# EAGLE design USB_5Vswitch (EAGLE 9.4.2)
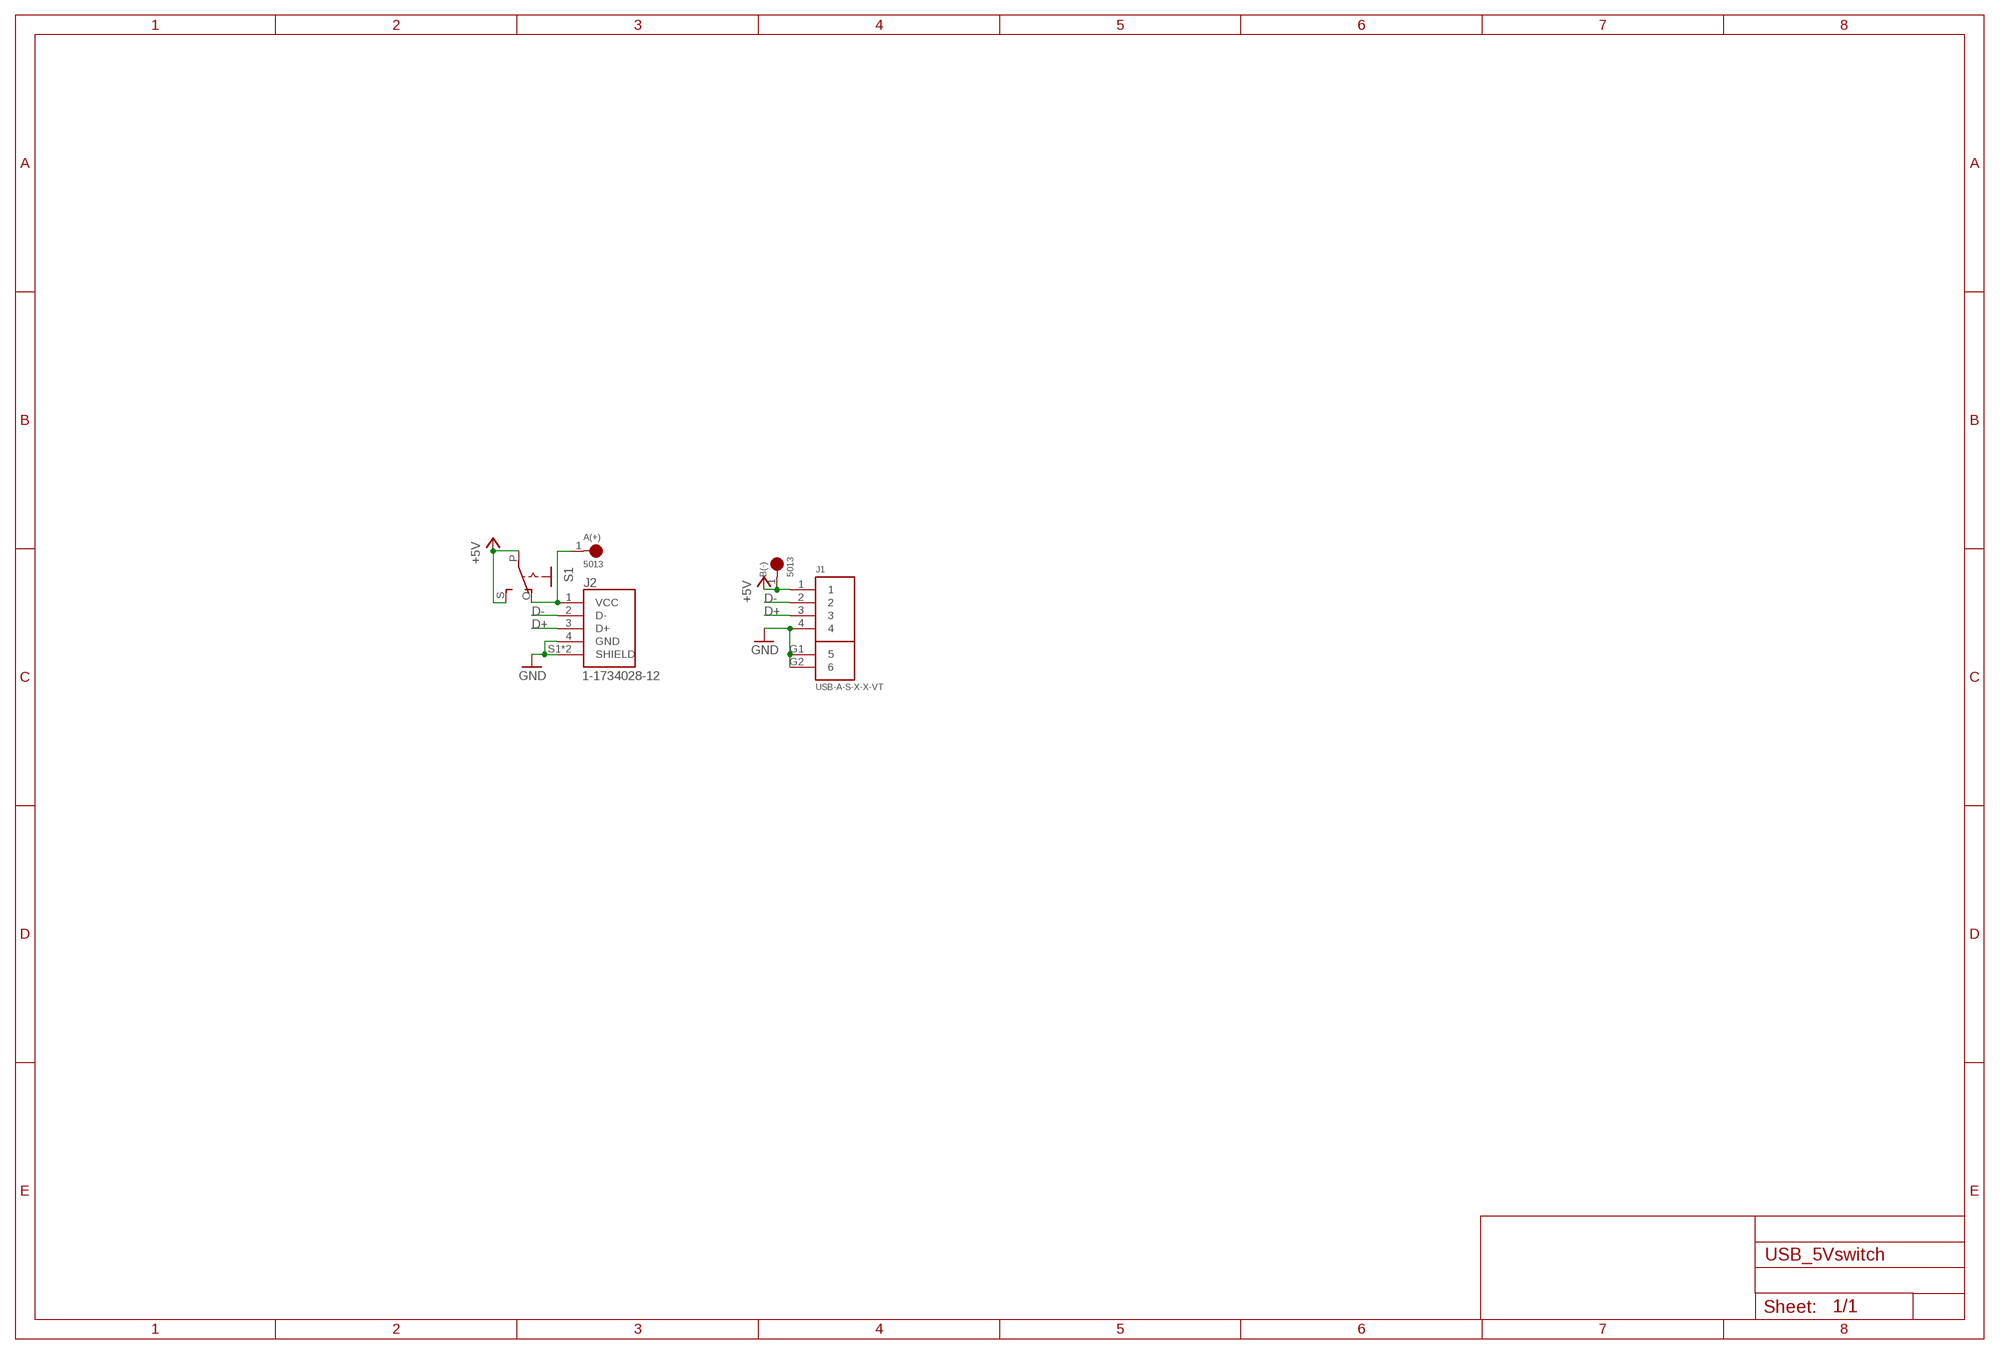
[diagram p0: schematic, sheet 1]

## Parts
A(+)  5013  [TESTPOINT_5013]
B(-)  5013  [TESTPOINT_5013]
J1  USB-A-S-X-X-VT  [USB-A-S-X-X-VT]
J2  1-1734028-12  [TE_1-1734028-2]
S1  EG1218S  [EG1218]

## Nets
+5V: B(-).1(TP) J1.1 S1.P S1.S
D+: J1.3 J2.3(D+)
D-: J1.2 J2.2(D-)
GND: J1.4 J1.G1 J1.G2 J2.4(GND) J2.S1(SHIELD) J2.S2(SHIELD)
N$1: A(+).1(TP) J2.1(VCC) S1.O

## Library data of the parts
A(+) B(-) = 5013:5013: Test Point; Orange; Thru-Hole; Snap-Fit; SilverPlate; 0.063in. Dia.; 0.445In.; AVAILABILITY: Unavailable; DESCRIPTION: Test Point; Orange; Thru-Hole; Snap-Fit; SilverPlate; 0.063in. Dia.; 0.445In.; MF: Keystone Electronics; MP: 5013; PACKAGE: TO-5 Keystone; PRICE: None
J1 = USB-A-S-X-X-VT:USB-A-S-X-X-VT: USB A, SINGLE, VERTICAL THROUGH HOLE.; AVAILABILITY: Unavailable; DESCRIPTION: Conn USB 2.0 Type A RCP 4 POS 2mm/2.5mm Solder ST Thru-Hole 4 Terminal 1 Port Tray; MF: Samtec; MP: USB-A-S-S-W-VT; PACKAGE: None; PRICE: None
J2 = 1-1734028-1:1-1734028-1: Conn USB 2.0 Type A PL 4 POS Solder RA SMD 4 Terminal 1 Port T/R
S1 = adafruit:EG1218: SLIDING SWITCH 0.1" spacing through hole, vertical SPDT slide switch http://www.ladyada.net/library/pcb/eaglelibrary.html

## Board
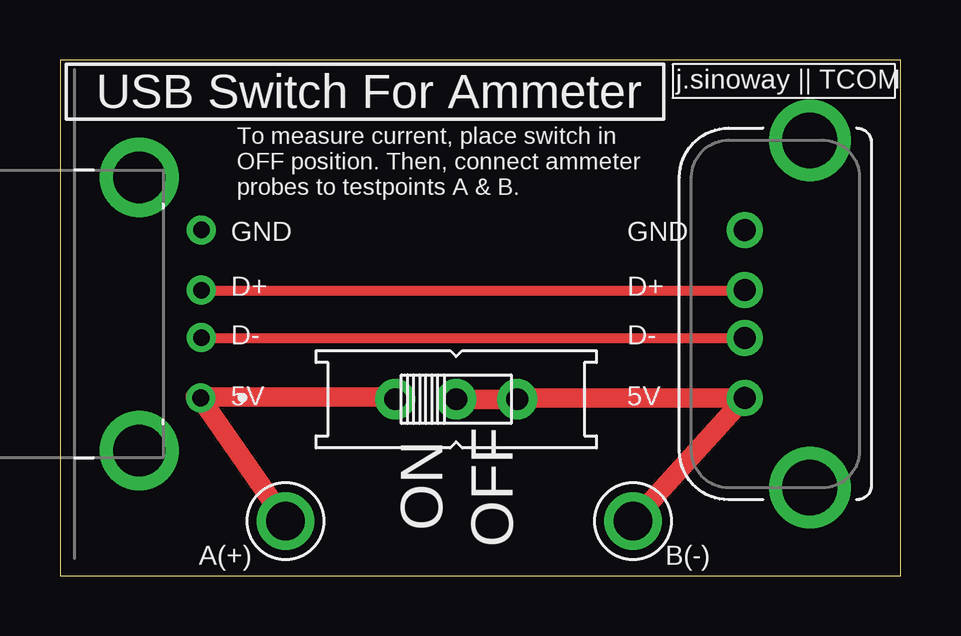
[diagram p1: board, top side]
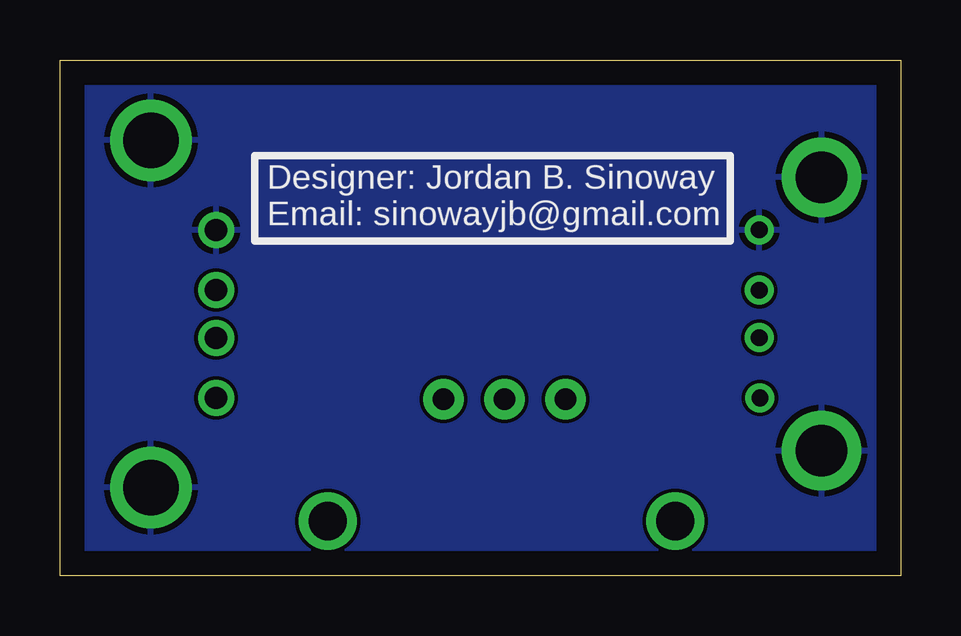
[diagram p2: board, bottom side, seen from below]

Size 35.03 x 21.51 mm. Coordinates in mm from the lower left corner, seen from the top.
Outline: 0,0 35.03,0 35.03,21.51 0,21.51 0,0
Copper layers (1*16): Top 0.035mm / dielectric 1.5mm / Bottom 0.035mm
Design rules "default": minimum track width 6mil, minimum drill 0.35mm, track to track 6mil, track to pad 6mil, pad to pad 6mil, via to via 6mil, smd to smd 6mil, copper to edge 40mil, drill to drill 6mil, minimum pad ring 10mil, minimum via ring 8mil, stop-mask expansion 4mil, vias tented up to drill 0mil, thermal gap 10mil

### Footprints (pad centres in the part's own frame; a part is rotated, then mirrored left to right if it is on the bottom)
TESTPOINT_5013 = drill 1.6: 1 0,0
USB-A-S-X-X-VT = drill 0.92 pad 1.5: 1 -3.5,2.71; 2 -1,2.71; 3 1,2.71; 4 3.5,2.71 | drill 2.3 pad 3.4: G1 -7.24,0; G2 7.24,0
TE_1-1734028-2 = drill 0.7: 1 4.775,8.915; 2 2.261,8.941; 3 0.279,8.941; 4 -2.235,8.941 | drill 2.159 pad 3.302: S1 -4.43,6.35; S2 6.97,6.35
EG1218 = drill 0.9 pad 1.676: O -2.54,0; P 0,0; S 2.54,0

### Placement (x,y rotation side)
A(+)  9.4,2.29 0 top
B(-)  23.88,2.29 0 top
J1  31.24,10.92 90 top
J2  -3.05,12.19 270 top
S1  16.51,7.37 0 top

### Tracks (layer width: path | path; a pad name or v marks a point on that pad's centre or on a via)
+5V
  Top 0.813: S1.P S1.S 19.05,7.42 J1.1 B(-).1
D+
  Top 0.152: 5.76,11.89 J2.3 | 28.5,11.89 J1.3
  Top 0.406: 28.5,11.89 5.76,11.89
D-
  Top 0.152: 5.76,9.91 J2.2 | 28.5,9.91 J1.2
  Top 0.406: 28.5,9.91 5.76,9.91
GND
  pour Bottom: 0.76,22.1 41.15,22.1 41.15,-0.25 0.76,-0.25
N$1
  Top 0.152: 5.63,7.47 5.85,7.42 J2.1 | 13.87,7.47 S1.O
  Top 0.813: 13.87,7.47 5.63,7.47 | A(+).1 5.85,7.42

### Text on the board
tNames: USB Switch For Ammeter | j.sinoway || TCOM | To measure current, place switch in / OFF position. Then, connect ammeter / probes to testpoints A & B. | GND | GND | D+ | D+ | D- | D- | 5V | 5V | ON / OFF
bNames: Designer: Jordan B. Sinoway / Email: sinowayjb@gmail.com